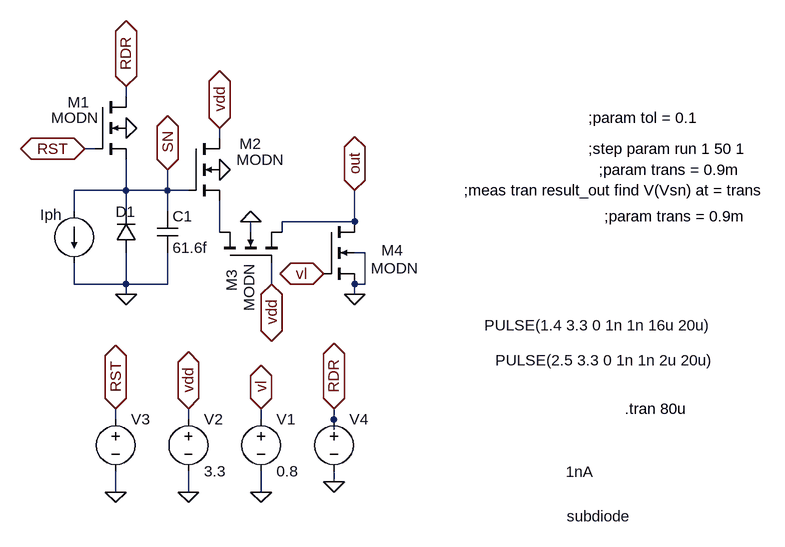
[diagram p0: schematic LIN LOG.asc]
LIN LOG.asc, the LTspice schematic file:
Version 4
SHEET 1 1380 680
WIRE 304 -176 304 -192
WIRE 448 -112 448 -128
WIRE 256 -96 240 -96
WIRE 304 -32 304 -80
WIRE 304 -32 224 -32
WIRE 368 -32 368 -64
WIRE 368 -32 304 -32
WIRE 400 -32 368 -32
WIRE 224 0 224 -32
WIRE 304 0 304 -32
WIRE 368 0 368 -32
WIRE 656 16 656 -32
WIRE 656 16 544 16
WIRE 448 32 448 -16
WIRE 496 32 496 16
WIRE 544 32 544 16
WIRE 672 64 656 64
WIRE 224 112 224 80
WIRE 304 112 304 64
WIRE 304 112 224 112
WIRE 368 112 368 64
WIRE 368 112 304 112
WIRE 528 112 528 80
WIRE 656 112 656 96
WIRE 672 112 672 64
WIRE 672 112 656 112
WIRE 304 128 304 112
WIRE 656 128 656 112
WIRE 288 320 288 304
WIRE 400 320 400 304
WIRE 512 320 512 304
WIRE 624 320 624 304
WIRE 624 336 624 320
WIRE 624 416 624 400
WIRE 288 432 288 400
WIRE 400 432 400 400
WIRE 512 432 512 400
FLAG 240 -96 RST
IOPIN 240 -96 BiDir
FLAG 512 432 0
FLAG 400 432 0
FLAG 288 432 0
FLAG 288 304 RST
IOPIN 288 304 BiDir
FLAG 304 -128 0
FLAG 304 128 0
FLAG 304 -192 RDR
IOPIN 304 -192 BiDir
FLAG 400 304 vdd
IOPIN 400 304 BiDir
FLAG 448 -64 0
FLAG 656 128 0
FLAG 608 96 vl
IOPIN 608 96 BiDir
FLAG 512 304 vl
IOPIN 512 304 BiDir
FLAG 624 304 RDR
IOPIN 624 304 BiDir
FLAG 624 416 0
FLAG 448 -128 vdd
IOPIN 448 -128 BiDir
FLAG 496 16 0
FLAG 528 112 vdd
IOPIN 528 112 BiDir
FLAG 656 -32 out
IOPIN 656 -32 BiDir
FLAG 368 -64 SN
IOPIN 368 -64 BiDir
SYMBOL voltage 512 304 R0
WINDOW 123 0 0 Left 2
WINDOW 39 0 0 Left 2
SYMATTR InstName V1
SYMATTR Value 0.8
SYMBOL voltage 400 304 R0
WINDOW 123 0 0 Left 2
WINDOW 39 0 0 Left 2
SYMATTR InstName V2
SYMATTR Value 3.3
SYMBOL voltage 288 304 R0
WINDOW 123 24 132 Left 2
WINDOW 39 0 0 Left 2
WINDOW 3 585 -75 Left 2
SYMATTR Value PULSE(2.5 3.3 0 1n 1n 2u 20u)
SYMATTR InstName V3
SYMBOL nmos4 256 -176 R0
WINDOW 0 -42 8 Left 2
WINDOW 3 -67 32 Left 2
SYMATTR InstName M1
SYMATTR Value MODN
SYMBOL nmos4 400 -112 R0
WINDOW 0 79 8 Left 2
WINDOW 3 74 33 Left 2
SYMATTR InstName M2
SYMATTR Value MODN
SYMBOL nmos4 608 16 R0
WINDOW 0 89 44 Left 2
WINDOW 3 73 72 Left 2
SYMATTR InstName M4
SYMATTR Value MODN
SYMBOL diode 320 64 R180
WINDOW 0 1 63 Left 2
WINDOW 3 -761 -405 Left 2
SYMATTR InstName D1
SYMATTR Value subdiode
SYMBOL current 224 0 R0
WINDOW 3 757 401 Left 2
WINDOW 123 0 0 Left 2
WINDOW 39 0 0 Left 2
WINDOW 0 -52 5 Left 2
SYMATTR Value 1nA
SYMATTR InstName Iph
SYMBOL voltage 624 304 R0
WINDOW 123 0 0 Left 2
WINDOW 39 0 0 Left 2
WINDOW 3 232 -129 Left 2
SYMATTR Value PULSE(1.4 3.3 0 1n 1n 16u 20u)
SYMATTR InstName V4
SYMBOL nmos4 448 80 R270
WINDOW 0 -44 19 Left 2
WINDOW 3 -74 46 Left 2
SYMATTR InstName M3
SYMATTR Value MODN
SYMBOL cap 352 0 R0
SYMATTR InstName C1
SYMATTR Value 61.6f
TEXT 1072 304 Left 2 !.tran 80u
TEXT 1016 -144 Left 2 !;param tol = 0.1
TEXT 1016 -96 Left 2 !;step param run 1 50 1
TEXT 1032 -64 Left 2 !;param trans = 0.9m
TEXT 824 -32 Left 2 !;meas tran result_out find V(Vsn) at = trans
TEXT 1040 8 Left 2 !;param trans = 0.9m

The netlist it stands for:
* LIN LOG.asc
V1 vl 0 0.8
V2 vdd 0 3.3
V3 RST 0 PULSE(2.5 3.3 0 1n 1n 2u 20u)
M1 RDR RST SN 0 MODN
M2 vdd SN N001 0 MODN
M4 out vl 0 0 MODN
D1 0 SN subdiode
Iph SN 0 1nA
V4 RDR 0 PULSE(1.4 3.3 0 1n 1n 16u 20u)
M3 N001 vdd out 0 MODN
C1 SN 0 61.6f
.model D D
.lib standard.dio
.model NMOS NMOS
.model PMOS PMOS
.lib standard.mos
.tran 80u
;param tol = 0.1
;step param run 1 50 1
;param trans = 0.9m
;meas tran result_out find V(Vsn) at = trans
;param trans = 0.9m
.backanno
.end